# Altium schematic sheet bias supply.SchDoc: 004-H-01 SD data logger
size A3; Organization: Sunflare Solar Team; Address1: Drachten; Address2: The Netherlands; Revision: V1.00; SheetNumber: 1; SheetTotal: 1
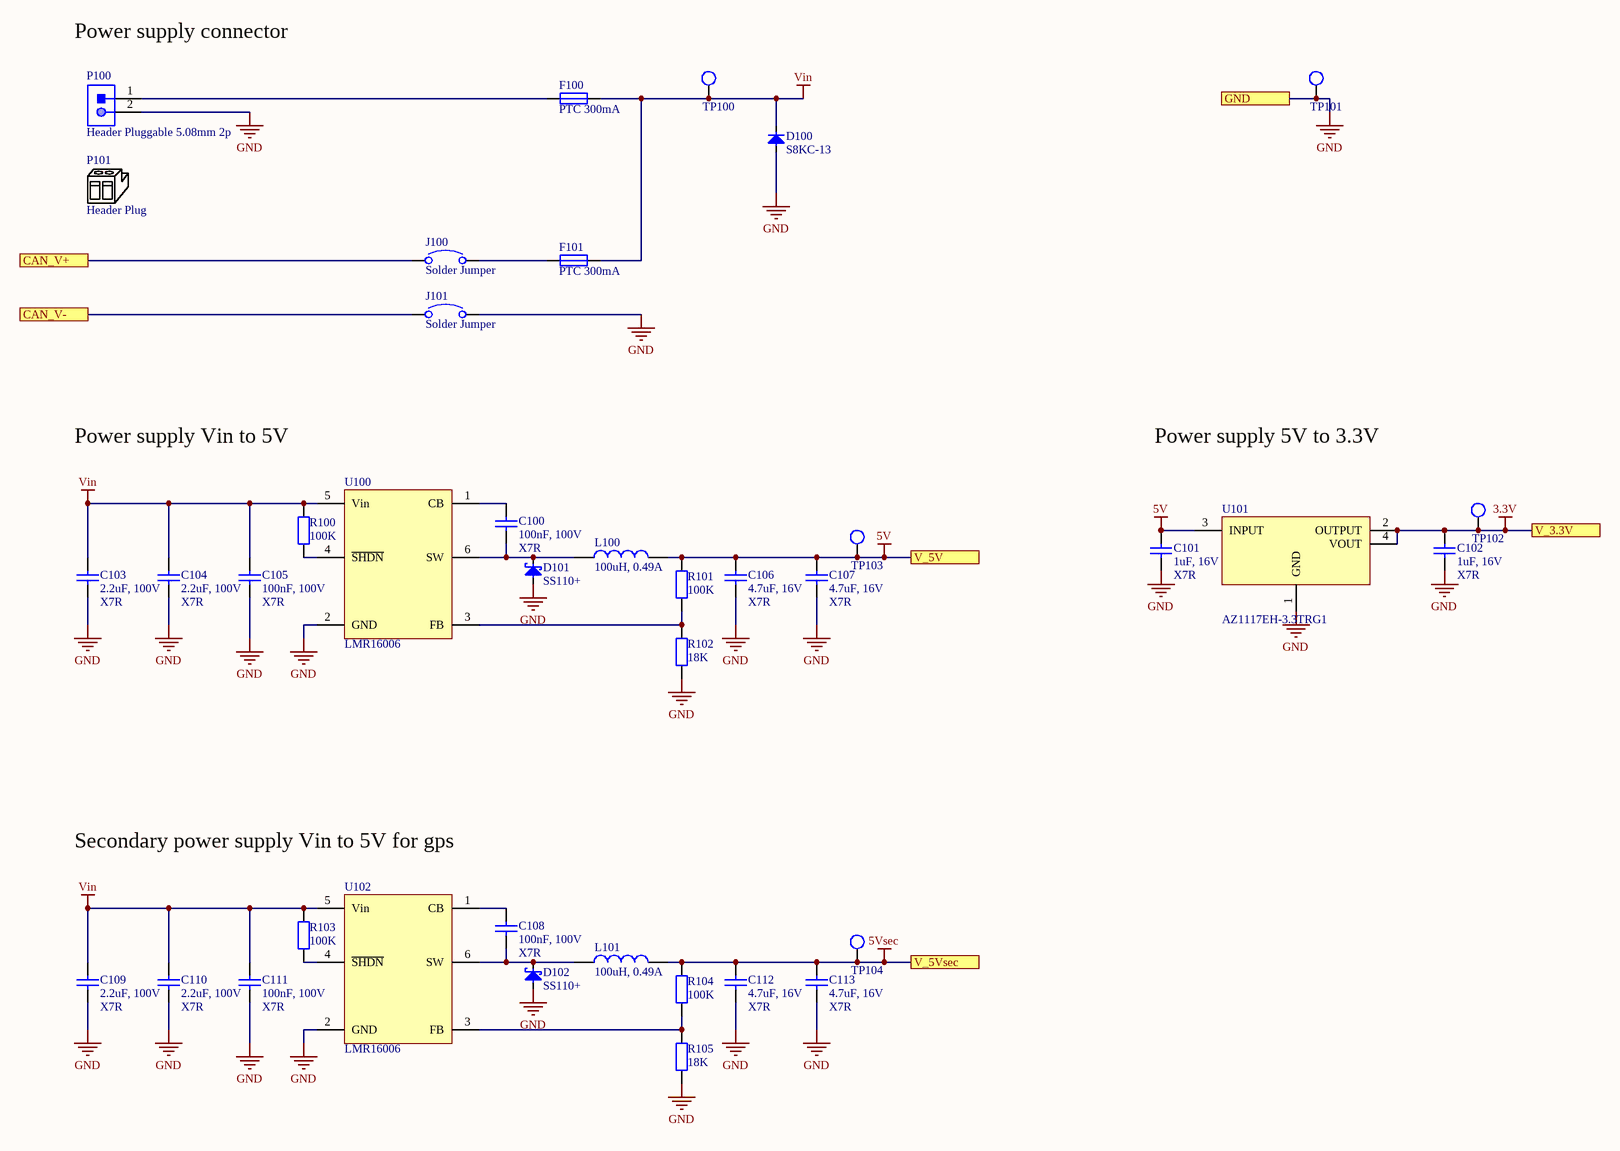
[diagram p0: bias supply.SchDoc]

## Parts
C100  100nF, 100V  Ceramic Type: X7R  [CAP_0805]
C101  1uF, 16V  Ceramic Type: X7R  [CAP_0805]
C102  1uF, 16V  Ceramic Type: X7R  [CAP_0805]
C103  2.2uF, 100V  Ceramic Type: X7R  [CAP_1210]
C104  2.2uF, 100V  Ceramic Type: X7R  [CAP_1210]
C105  100nF, 100V  Ceramic Type: X7R  [CAP_0805]
C106  4.7uF, 16V  Ceramic Type: X7R  [CAP_0805]
C107  4.7uF, 16V  Ceramic Type: X7R  [CAP_0805]
C108  100nF, 100V  Ceramic Type: X7R  [CAP_0805]
C109  2.2uF, 100V  Ceramic Type: X7R  [CAP_1210]
C110  2.2uF, 100V  Ceramic Type: X7R  [CAP_1210]
C111  100nF, 100V  Ceramic Type: X7R  [CAP_0805]
C112  4.7uF, 16V  Ceramic Type: X7R  [CAP_0805]
C113  4.7uF, 16V  Ceramic Type: X7R  [CAP_0805]
D100  S8KC-13  [DIODEDO-214AB]
D101  SS110+  [DIODEDO-214AC]
D102  SS110+  [DIODEDO-214AC]
F100  PTC 300mA  [PTC7451X12N]
F101  PTC 300mA  [PTC7451X12N]
J100  Solder Jumper  [SolderJumer]  (no BOM)
J101  Solder Jumper  [SolderJumer]  (no BOM)
L100  100uH, 0.49A  [WE-LQS_4025]
L101  100uH, 0.49A  [WE-LQS_4025]
P100  Header Pluggable 5.08mm 2p  [WE-691313510002]
P101  Header Plug  (mechanical)
R100  100K  [RES_0805]
R101  100K  [RES_0805]
R102  18K  [RES_0805]
R103  100K  [RES_0805]
R104  100K  [RES_0805]
R105  18K  [RES_0805]
TP100  Test Pad  [TestPad]  (value not drawn)  (no BOM)
TP101  Test Pad  [TestPad]  (value not drawn)  (no BOM)
TP102  Test Pad  [TestPad]  (value not drawn)  (no BOM)
TP103  Test Pad  [TestPad]  (value not drawn)  (no BOM)
TP104  Test Pad  [TestPad]  (value not drawn)  (no BOM)
U100  LMR16006  [SOT95P280X110-6N]
U101  AZ1117EH-3.3TRG1  [FP-SOT223-IPC_A]
U102  LMR16006  [SOT95P280X110-6N]

## Ports
CAN_V+, CAN_V-, GND, V_3.3V, V_5V, V_5Vsec

## Nets
3.3V: C102.1 TP102.1 U101.2(OUTPUT) U101.4(VOUT) ; port V_3.3V
5V: C101.2 C106.2 C107.1 L100.2 R101.2 TP103.1 U101.3(INPUT) ; port V_5V
5Vsec: C112.2 C113.1 L101.2 R104.2 TP104.1 ; port V_5Vsec
GND: C101.1 C102.2 C103.1 C104.2 C105.1 C106.1 C107.2 C109.1 C110.2 C111.1 C112.1 C113.2 D100.2(A) D101.2(A) D102.2(A) J101.2 P100.2 R102.1 R105.1 TP101.1 U100.2(GND) U101.1(GND) U102.2(GND) ; port GND
Vin: C103.2 C104.1 C105.2 C109.2 C110.1 C111.2 D100.1(K) F100.2 F101.2 R100.2 R103.2 TP100.1 U100.5(Vin) U102.5(Vin)
CAN_V+: J100.1 ; port CAN_V+
CAN_V-: J101.1 ; port CAN_V-
NetC100_1: C100.1 U100.1(CB)
NetC100_2: C100.2 D101.1(K) L100.1 U100.6(SW)
NetC108_1: C108.1 U102.1(CB)
NetC108_2: C108.2 D102.1(K) L101.1 U102.6(SW)
NetF100_1: F100.1 P100.1
NetF101_1: F101.1 J100.2
NetR100_1: R100.1 U100.4(~{SHDN})
NetR101_1: R101.1 R102.2 U100.3(FB)
NetR103_1: R103.1 U102.4(~{SHDN})
NetR104_1: R104.1 R105.2 U102.3(FB)

## Notes on the sheet
- Power supply connector
- Power supply Vin to 5V
- Power supply 5V to 3.3V
- Secondary power supply Vin to 5V for gps
- Title
- Size:
- Date:
- A3
- Version:
- Sheet
- of

## Library data of the parts
C100 C105 C108 C111 = CAP_0805_100nF_100V: WCAP-CSGP Multilayer Ceramic Chip Capacitor, General Purpose, size 0805, X7R, 100nF, 100V; Manufacturer Part Number: 885012207128; Manufacturer: Wurth Elektronik; Rated Voltage: 100VDC; Isolation Resistance: >=1GOhm; Capacitance Tolerance: +/-10%; Technical Reference: X7R0805104K100DFCT10000; ComponentLink1Description: Manufacturer; ComponentLink1URL: http://www.we-online.de; ComponentLink2Description: Datasheet; ComponentLink2URL: https://www.we-online.com/catalog/datasheet/885012207128.pdf; Operating Temperature: -55 to +125degC; Packaging: Tape and Reel; Published Date: May 2020; Dissipation Factor: =<2.5%; Height: 1.25mm; Mounting Technology: SMT; Size: 0805; Capacitance: 100nF; Supplier 1: Farnell; Supplier Part Number 1: 2812440
C101 C102 = CAP_0805_1uF_16V: WCAP-CSGP Multilayer Ceramic Chip Capacitor, General Purpose, size 0805, X7R, 1uF, 16V; Manufacturer Part Number: 885012207051; Manufacturer: Wurth Elektronik; Rated Voltage: 16VDC; Isolation Resistance: >=0.5GOhm; Capacitance Tolerance: +/-10%; Technical Reference: X7R0805105K016DFCT10000; ComponentLink1Description: Manufacturer; ComponentLink1URL: http://www.we-online.de; ComponentLink2Description: Datasheet; ComponentLink2URL: https://www.we-online.com/catalog/datasheet/885012207051.pdf; Operating Temperature: -55 to +125degC; Packaging: Tape and Reel; Published Date: May 2020; Dissipation Factor: =<5%; Height: 1.25mm; Mounting Technology: SMT; Size: 0805; Capacitance: 1uF; Supplier 1: Farnell; Supplier Part Number 1: 2534058
C103 C104 C109 C110 = CAP_1210_2.2uF_100V: WCAP-CSGP Multilayer Ceramic Chip Capacitor, General Purpose, size 1210, X7R, 2.2uF, 100V; Manufacturer Part Number: 885012209071; Manufacturer: Wurth Elektronik; Rated Voltage: 100VDC; Isolation Resistance: >=0.05GOhm; Capacitance Tolerance: +/-10%; Technical Reference: X7R1210225K100DFCT10000; ComponentLink1Description: Manufacturer; ComponentLink1URL: http://www.we-online.de; ComponentLink2Description: Datasheet; ComponentLink2URL: https://www.we-online.com/catalog/datasheet/885012209071.pdf; Operating Temperature: -55 to +125degC; Packaging: Tape and Reel; Published Date: May 2020; Dissipation Factor: =<5%; Height: 2.5mm; Mounting Technology: SMT; Size: 1210; Capacitance: 2.2uF
C106 C107 C112 C113 = CAP_0805_4.7uF_16V: WCAP-CSGP Multilayer Ceramic Chip Capacitor, General Purpose, size 0805, X7R, 4.7uF, 16V; Manufacturer Part Number: 885012207053; Manufacturer: Wurth Elektronik; Rated Voltage: 16VDC; Isolation Resistance: >=0.02GOhm; Capacitance Tolerance: +/-10%; Technical Reference: X7R0805475K016DFCT10000; ComponentLink1Description: Manufacturer; ComponentLink1URL: http://www.we-online.de; ComponentLink2Description: Datasheet; ComponentLink2URL: https://www.we-online.com/catalog/datasheet/885012207053.pdf; Operating Temperature: -55 to +125degC; Packaging: Tape and Reel; Published Date: May 2020; Dissipation Factor: =<10%; Height: 1.25mm; Mounting Technology: SMT; Size: 0805; Capacitance: 4.7uF; Supplier 1: Farnell; Supplier Part Number 1: 2495191
D100 = Diode S8KC-13: Diode; Manufacturer: Diodes inc; Manufacturer Part No: S8KC-13; Supplier 1: Farnell; Supplier Part Number 1: 3127431; Supplier 2: Farnell; Supplier Part Number 2: 2675073
D101 D102 = Diode Schottky SS110+: Diode Schottky; Manufacturer: Multicomp; Manufacturer Part No: SS110+; Supplier 1: Farnell; Supplier Part Number 1: 4085140
F100 F101 = PTC 300mA: Fuse; Manufacturer: Multicomp Pro; Manufacturer Part No: MC33189; Supplier 1: Farnell; Supplier Part Number 1: 1800748
J100 J101 = SolderJumper: Solder jumper open; Manufacturer: -; Manufacturer Part No: -
L100 L101 = Inductor 100uH 0.49A 1043mOhm: WE-LQS SMT Power Inductor, size 4025, 100uH, 0.49A; Manufacturer: Wurth Elektronik; Manufacturer Part Number: 74404043101A; Saturation Current: 0.29A; Self Resonant Frequency: 11MHz; ComponentLink1Description: Manufacturer; ComponentLink1URL: http://www.we-online.de; ComponentLink2Description: Datasheet; ComponentLink2URL: https://www.we-online.com/catalog/datasheet/74404043101A.pdf; Published Date: May 2020; Rated Current: 0.49A; DC Resistance: 1043mOhm; Operating Temperature: -40 to +125degC; Mounting Technology: SMT; Packaging: Tape and Reel; Inductance: 100uH; Size: 4025; Supplier 1: Farnell; Supplier Part Number 1: 2749073
P100 = Header Pluggable 5.08mm 2p: WR-TBL Serie 313 Close Horizontal PCB Header, Pluggable, pitch 5.08mm, 2p; Part Number: 691313510002; Compliance: RoHS; Modularity: No; Pin Number: 2; Rated Current [UL]: 20A; Working Voltage [UL]: 300VAC; ComponentLink1Description: Manufacturer; ComponentLink1URL: http://www.we-online.de; ComponentLink2URL: https://katalog.we-online.de/em/datasheet/691313510002.pdf; ComponentLink2Description: Datasheet; Mounting Technology: THT; Packaging: Box; Operating Temperature: -40 to +105degC; PCB/Cable/Panel: PCB; Pitch: 5.08mm; Published Date: October 2019; Type: Horizontal; Publisher: Wurth Elektronik; Application: Pluggable; Supplier 1: Farnell; Supplier Part Number 1: 1641993
P101 = Plug Pluggable 5.08mm 2p: WR-TBL Series 351 - 5.08 mm Vertical, pitch 5.08mm, 2p; Part Number: 691351500002; Compliance: RoHS; Modularity: No; PCB/Cable/Panel: Cable; Pin Number: 2; Rated Current [UL]: 20A; Working Voltage [UL]: 300VAC; ComponentLink1Description: Manufacturer; ComponentLink1URL: http://www.we-online.de; ComponentLink2URL: https://katalog.we-online.de/em/datasheet/691313510002.pdf; ComponentLink2Description: Datasheet; Packaging: Box; Operating Temperature: -40 to +105degC; Pitch: 5.08mm; Published Date: October 2019; Type: Plug; Publisher: Wurth Elektronik; Application: Pluggable; Supplier 1: Farnell; Supplier Part Number 1: 1641952
R100 R101 R103 R104 = RES_0805_100K: Thick Film Resistor, size 0805, 1%; Rated Power: 0.125W; Resistance Tolerance: +/-1%; Resistance: 100K; Height: 0.6mm; Operating Temperature: -55 to +155degC; Mounting Technology: SMT; Packaging: Tape and Reel; Size: 0805; Length: 2mm; Width: 1.25mm
R102 R105 = RES_0805_18K: Thick Film Resistor, size 0805, 1%; Rated Power: 0.125W; Resistance Tolerance: +/-1%; Resistance: 18K; Height: 0.6mm; Operating Temperature: -55 to +155degC; Mounting Technology: SMT; Packaging: Tape and Reel; Size: 0805; Length: 2mm; Width: 1.25mm
TP100-TP104 = Test Pad: Test pad 2mm; Manufacturer: -; Manufacturer Part No: -
U100 U102 = LMR16006: DC-DC Switching Buck (Step Down) Regulator, Adjustable, 4V-60Vin, 800mV-55Vout, 600mAout, TSOT-23-6; Manufacturer: Texas Instruments; Manufacturer Part No: LMR16006XDDCT; Supplier 1: Farnell; Supplier Part Number 1: 3121632
U101 = AZ1117EH-3.3TRG1: IC REG LINEAR 3.3V 1A SOT223; Manufacturer: Diodes Inc; Operating Supply Current: 3.5mA; Polarity: Positive; Reference Voltage: 1.262V; Max Input Voltage: 13V; Accuracy: 1%; Power Supply Rejection Ratio (PSRR): 70dB; Number of Regulators: 1; Dropout Voltage: 1.1V; Output Type: Fixed; Output Voltage: 3.3V; Package Quantity: 4000; Lead Free: Lead Free; Number of Pins: 3; Output Current: 1A; Packaging: Tape and Reel; Min Operating Temperature: -40°C; Max Operating Temperature: 125°C; Quiescent Current: 3.5mA; Contact Plating: Tin; Case/Package: TO-261-4; Weight: 0.000282oz; Mount: Surface Mount; Number of Outputs: 1; Max Output Current: 1A; Manufacturer Part Number: AZ1117EH-3.3TRG1; Supplier 1: Farnell; Supplier Part Number 1: 3483084